# Altium schematic sheet HLK-7621-ALL-KIT-V1.0(020.2.25).SchDoc
size A1
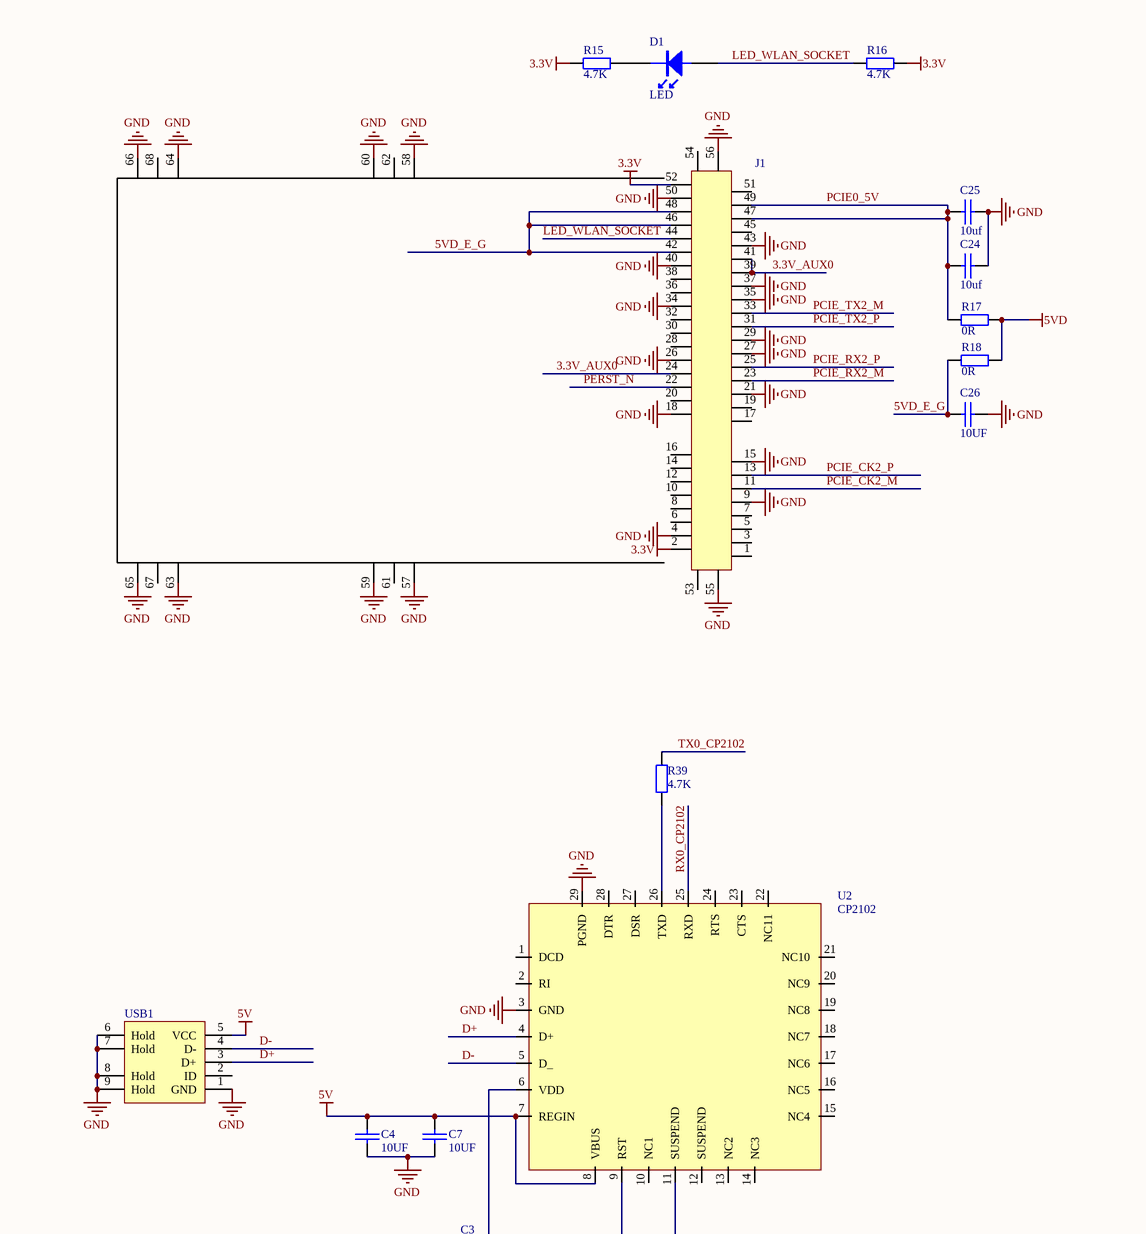
[diagram p0: HLK-7621-ALL-KIT-V1.0(020.2.25).SchDoc, top left]
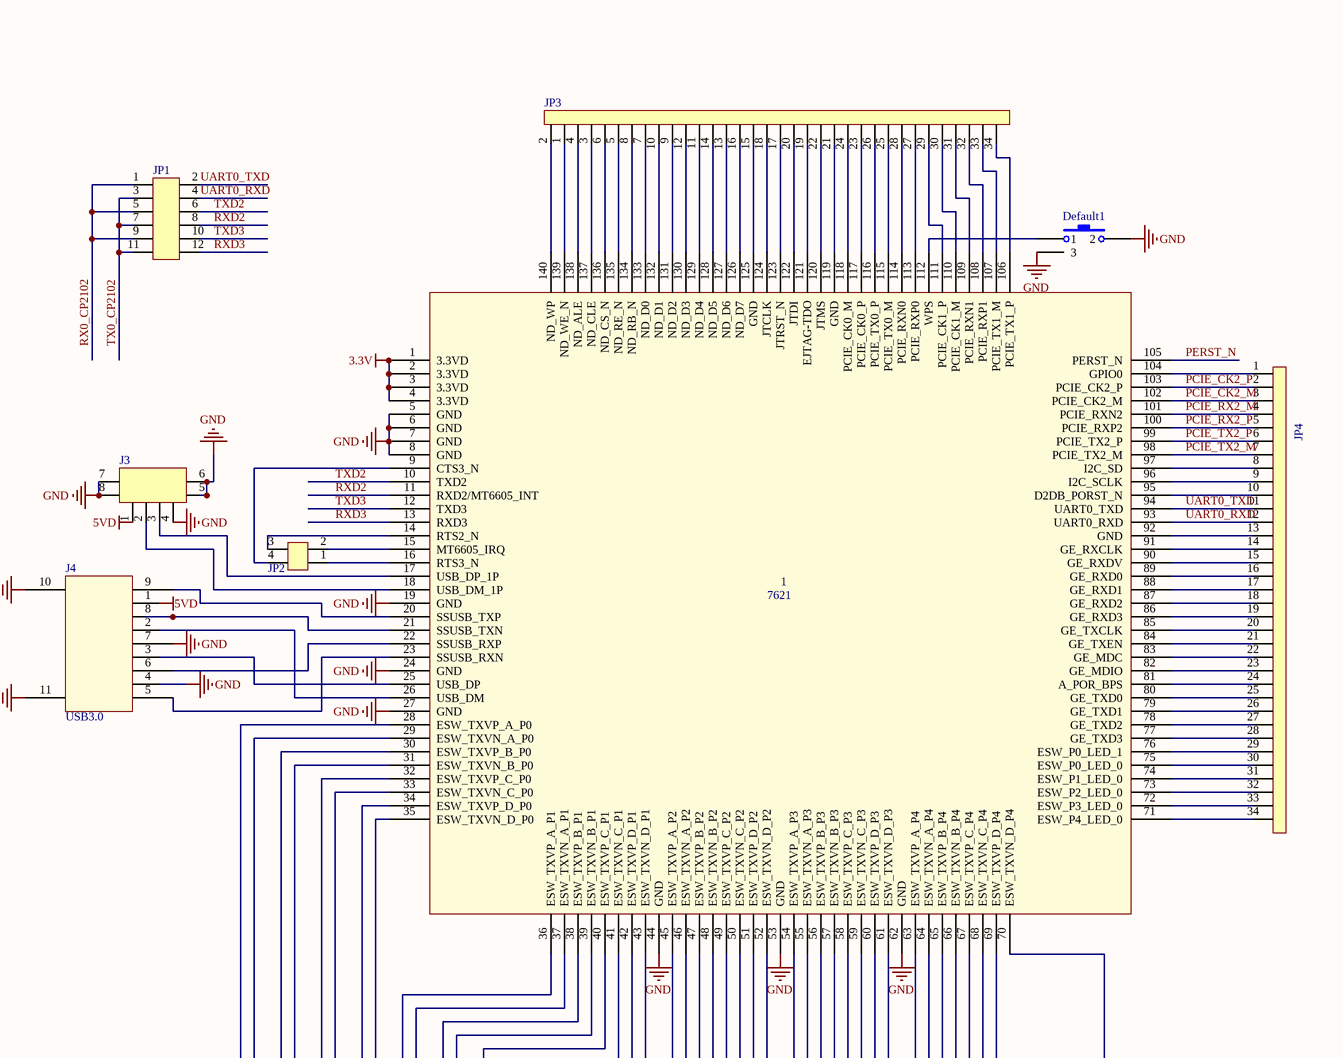
[diagram p1: HLK-7621-ALL-KIT-V1.0(020.2.25).SchDoc, top right]
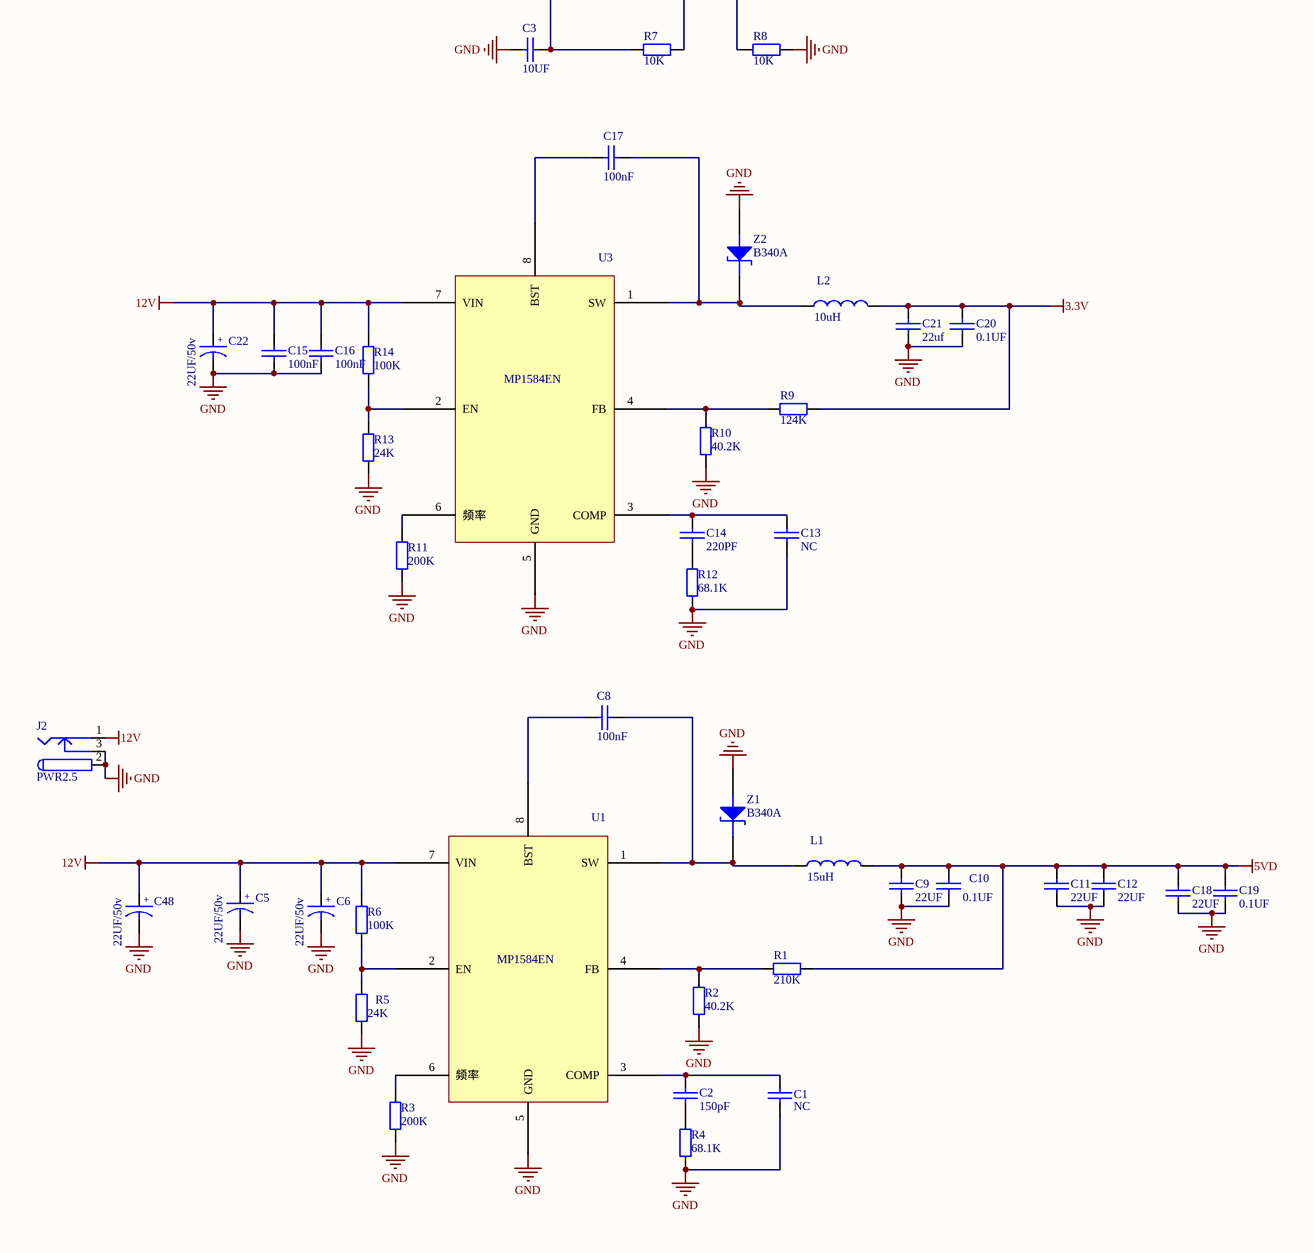
[diagram p2: HLK-7621-ALL-KIT-V1.0(020.2.25).SchDoc, bottom left]
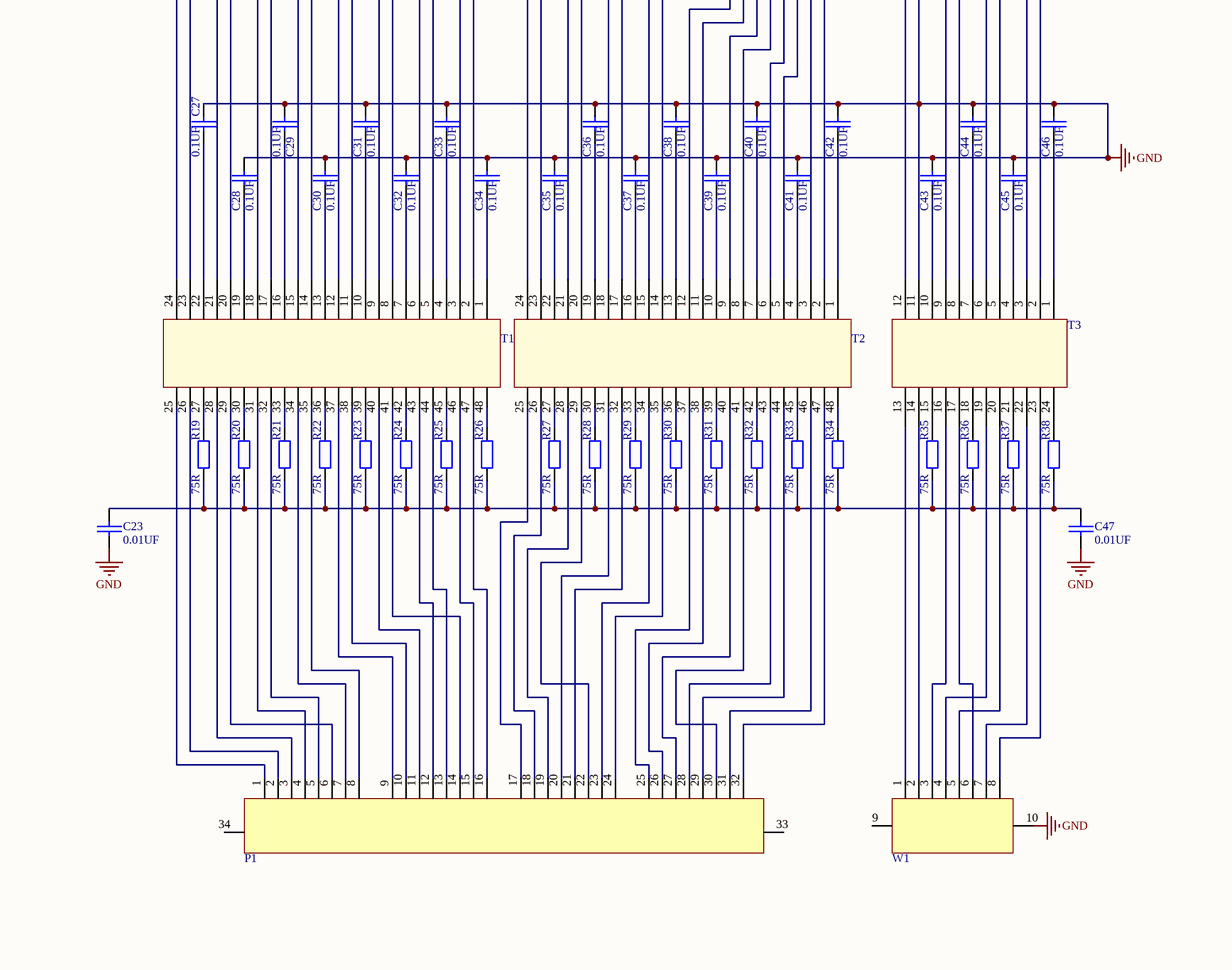
[diagram p3: HLK-7621-ALL-KIT-V1.0(020.2.25).SchDoc, bottom right]

## Parts
1  7621  [HLK-7621]
C1  NC  [0603]
C2  150pF  [0603]
C3  10UF  [0603L]
C4  10UF  [0603L]
C5  22UF/50v  [0603]
C6  22UF/50v  [0603]
C7  10UF  [0603L]
C8  100nF  [0603]
C9  22UF  [0603]
C10  0.1UF  [0603]
C11  22UF  [0603]
C12  22UF  [0603]
C13  NC  [0603]
C14  220PF  [0603]
C15  100nF  [0603]
C16  100nF  [0603]
C17  100nF  [0603]
C18  22UF  [0603]
C19  0.1UF  [0603]
C20  0.1UF  [0603]
C21  22uf  [0603]
C22  22UF/50v  [CAP_SMT_8*10.5]
C23  0.01UF  [C1206]
C24  10uf  [C1206]
C25  10uf  [C1206]
C26  10UF  [C1206]
C27  0.1UF  [C0402]
C28  0.1UF  [C0402]
C29  0.1UF  [C0402]
C30  0.1UF  [C0402]
C31  0.1UF  [C0402]
C32  0.1UF  [C0402]
C33  0.1UF  [C0402]
C34  0.1UF  [C0402]
C35  0.1UF  [C0402]
C36  0.1UF  [C0402]
C37  0.1UF  [C0402]
C38  0.1UF  [C0402]
C39  0.1UF  [C0402]
C40  0.1UF  [C0402]
C41  0.1UF  [C0402]
C42  0.1UF  [C0402]
C43  0.1UF  [C0402]
C44  0.1UF  [C0402]
C45  0.1UF  [C0402]
C46  0.1UF  [C0402]
C47  0.01UF  [C1206]
C48  22UF/50v  [CAP_SMT_8*10.5]
D1  LED  [C1206]
Default1  SW-PB  [K5]  (value not drawn)
J1  (no value)  [CONSG/54/MINICARD/AS0B22-S68-7F/HALF/FUL]
J2  PWR2.5
J3  (no value)
J4  USB3.0
JP1  (no value)  [HDR2X6]
JP2  (no value)  [HDR2X2]
JP3  (no value)  [HDR2X17]
JP4  2  [HDR2X17]  (value not drawn)
L1  15uH  [CD105]
L2  10uH  [CD105]
P1  Component_2  [PHJ8X4_N]  (value not drawn)
R1  210K  [0603]
R2  40.2K  [0603]
R3  200K  [0603]
R4  68.1K  [0603]
R5  24K  [0603]
R6  100K  [0603]
R7  10K  [0603L]
R8  10K  [0603L]
R9  124K  [0603]
R10  40.2K  [0603]
R11  200K  [0603]
R12  68.1K  [0603]
R13  24K  [0603]
R14  100K  [0603]
R15  4.7K  [0603]
R16  4.7K  [0603]
R17  0R  [L0805]
R18  0R  [R1206]
R19  75R  [R0402]
R20  75R  [R0402]
R21  75R  [R0402]
R22  75R  [R0402]
R23  75R  [R0402]
R24  75R  [R0402]
R25  75R  [R0402]
R26  75R  [R0402]
R27  75R  [R0402]
R28  75R  [R0402]
R29  75R  [R0402]
R30  75R  [R0402]
R31  75R  [R0402]
R32  75R  [R0402]
R33  75R  [R0402]
R34  75R  [R0402]
R35  75R  [R0402]
R36  75R  [R0402]
R37  75R  [R0402]
R38  75R  [R0402]
R39  4.7K  [0603]
T1  TRANSFORMER/24P/SMD/HN2429CG  [TRANSFORMER/48P/SMD/GS5014LF]  (value not drawn)
T2  TRANSFORMER/24P/SMD/HN2429CG  [TRANSFORMER/48P/SMD/GS5014LF]  (value not drawn)
T3  TRANSFORMER/24P/SMD/HN2429CG  [TRANSFORMER/24P/SMD/HN2429CG]  (value not drawn)
U1  MP1584EN  [SOP8_150]
U2  CP2102  [cp2102]
U3  MP1584EN  [SOP8_150]
USB1  USB1  [usb]  (value not drawn)
W1  Component_3  [PCBComponent_1]  (value not drawn)
Z1  B340A  [SMA]
Z2  B340A  [SMA]

## Nets
3.3V: 1.1(3.3VD) 1.2(3.3VD) 1.3(3.3VD) 1.4(3.3VD) C20.1 C21.1 J1.2 J1.52 L2.1 R9.1 R15.2 R16.1
5V: C4.2 C7.2 U2.7(REGIN) U2.8(VBUS) USB1.5(VCC)
5VD: C9.1 C10.1 C11.1 C12.1 C18.1 C19.1 J3.1 J4.1 L1.1 R1.1 R17.2 R18.1
12V: C5.1 C6.1 C15.1 C16.1 C22.1 C48.1 J2.1 R6.2 R14.2 U1.7(VIN) U3.7(VIN)
GND: 1.5(GND) 1.6(GND) 1.7(GND) 1.8(GND) 1.19(GND) 1.24(GND) 1.27(GND) 1.44(GND) 1.53(GND) 1.62(GND) 1.64(ESW_TXVN_A_P4) C1.2 C3.1 C4.1 C5.2 C6.2 C7.1 C9.2 C10.2 C11.2 C12.2 C13.2 C15.2 C16.2 C18.2 C19.2 C20.2 C21.2 C22.2 C23.2 C24.2 C25.2 C26.2 C27.1 C28.1 C29.1 C30.1 C31.1 C32.1 C33.1 C34.1 C35.1 C36.1 C37.1 C38.1 C39.1 C40.1 C41.1 C42.1 C43.1 C44.1 C45.1 C46.1 C47.2 C48.2 Default1.2 Default1.3 J1.4 J1.9 J1.15 J1.18 J1.21 J1.26 J1.27 J1.29 J1.34 J1.35 J1.37 J1.40 J1.43 J1.50 J1.55 J1.56 J1.57 J1.58 J1.59 J1.60 J1.63 J1.64 J1.65 J1.66 J2.2 J2.3 J3.4 J3.5 J3.6 J3.7 J3.8 J4.4 J4.7 J4.10 J4.11 R2.1 R3.1 R4.1 R5.1 R8.1 R10.1 R11.1 R12.1 R13.1 T3.11 U1.5(GND) U2.3(GND) U2.29(PGND) U3.5(GND) USB1.1(GND) USB1.6(Hold) USB1.7(Hold) USB1.8(Hold) USB1.9(Hold) W1.10 Z1.1(A) Z2.1(A)
3.3V_AUX0: J1.24 J1.39 J1.41
5VD_E_G: C26.1 J1.42 J1.46 J1.48 R18.2
D+: U2.4(D+) USB1.3(D+)
D-: U2.5(D_) USB1.4(D-)
LED_WLAN_SOCKET: D1.1 J1.44 R16.2
PCIE0_5V: C24.1 C25.1 J1.47 J1.49 R17.1
PCIE_CK2_M: 1.102(PCIE_CK2_M) J1.11 JP4.3
PCIE_CK2_P: 1.103(PCIE_CK2_P) J1.13 JP4.2
PCIE_RX2_M: 1.101(PCIE_RXN2) J1.23 JP4.4
PCIE_RX2_P: 1.100(PCIE_RXP2) J1.25 JP4.5
PCIE_TX2_M: 1.98(PCIE_TX2_M) J1.33 JP4.7
PCIE_TX2_P: 1.99(PCIE_TX2_P) J1.31 JP4.6
PERST_N: 1.105(PERST_N) J1.22
RX0_CP2102: JP1.1 JP1.5 JP1.9 U2.25(RXD)
RXD2: 1.11(RXD2/MT6605_INT) JP1.8
RXD3: 1.13(RXD3) JP1.12
TX0_CP2102: JP1.3 JP1.7 JP1.11 R39.1
TXD2: 1.10(TXD2) JP1.6
TXD3: 1.12(TXD3) JP1.10
UART0_RXD: 1.93(UART0_RXD) JP1.4 JP4.12
UART0_TXD: 1.94(UART0_TXD) JP1.2 JP4.11
Net1_9: 1.9(CTS3_N) JP2.4
Net1_14: 1.14(RTS2_N) JP2.3
Net1_15: 1.15(MT6605_IRQ) JP2.2
Net1_16: 1.16(RTS3_N) JP2.1
Net1_17: 1.17(USB_DP_1P) J3.3
Net1_18: 1.18(USB_DM_1P) J3.2
Net1_20: 1.20(SSUSB_TXP) J4.9
Net1_21: 1.21(SSUSB_TXN) J4.8
Net1_22: 1.22(SSUSB_RXP) J4.6
Net1_23: 1.23(SSUSB_RXN) J4.5
Net1_25: 1.25(USB_DP) J4.3
Net1_26: 1.26(USB_DM) J4.2
Net1_28: 1.28(ESW_TXVP_A_P0) T1.24
Net1_29: 1.29(ESW_TXVN_A_P0) T1.23
Net1_30: 1.30(ESW_TXVP_B_P0) T1.21
Net1_31: 1.31(ESW_TXVN_B_P0) T1.20
Net1_32: 1.32(ESW_TXVP_C_P0) T1.18
Net1_33: 1.33(ESW_TXVN_C_P0) T1.17
Net1_34: 1.34(ESW_TXVP_D_P0) T1.15
Net1_35: 1.35(ESW_TXVN_D_P0) T1.14
Net1_36: 1.36(ESW_TXVP_A_P1) T1.12
Net1_37: 1.37(ESW_TXVN_A_P1) T1.11
Net1_38: 1.38(ESW_TXVP_B_P1) T1.9
Net1_39: 1.39(ESW_TXVN_B_P1) T1.8
Net1_40: 1.40(ESW_TXVP_C_P1) T1.6
Net1_41: 1.41(ESW_TXVN_C_P1) T1.5
Net1_42: 1.42(ESW_TXVP_D_P1) T1.3
Net1_43: 1.43(ESW_TXVN_D_P1) T1.2
Net1_45: 1.45(ESW_TXVP_A_P2) T2.24
Net1_46: 1.46(ESW_TXVN_A_P2) T2.23
Net1_47: 1.47(ESW_TXVP_B_P2) T2.21
Net1_48: 1.48(ESW_TXVN_B_P2) T2.20
Net1_49: 1.49(ESW_TXVP_C_P2) T2.18
Net1_50: 1.50(ESW_TXVN_C_P2) T2.17
Net1_51: 1.51(ESW_TXVP_D_P2) T2.15
Net1_52: 1.52(ESW_TXVN_D_P2) T2.14
Net1_54: 1.54(ESW_TXVP_A_P3) T2.12
Net1_55: 1.55(ESW_TXVN_A_P3) T2.11
Net1_56: 1.56(ESW_TXVP_B_P3) T2.9
Net1_57: 1.57(ESW_TXVN_B_P3) T2.8
Net1_58: 1.58(ESW_TXVP_C_P3) T2.6
Net1_59: 1.59(ESW_TXVN_C_P3) T2.5
Net1_60: 1.60(ESW_TXVP_D_P3) T2.3
Net1_61: 1.61(ESW_TXVN_D_P3) T2.2
Net1_63: 1.63(ESW_TXVP_A_P4) T3.12
Net1_65: 1.65(ESW_TXVP_B_P4) T3.9
Net1_66: 1.66(ESW_TXVN_B_P4) T3.8
Net1_67: 1.67(ESW_TXVP_C_P4) T3.6
Net1_68: 1.68(ESW_TXVN_C_P4) T3.5
Net1_69: 1.69(ESW_TXVP_D_P4) T3.3
Net1_70: 1.70(ESW_TXVN_D_P4) T3.2
Net1_71: 1.71(ESW_P4_LED_0) JP4.34
Net1_72: 1.72(ESW_P3_LED_0) JP4.33
Net1_73: 1.73(ESW_P2_LED_0) JP4.32
Net1_74: 1.74(ESW_P1_LED_0) JP4.31
Net1_75: 1.75(ESW_P0_LED_0) JP4.30
Net1_76: 1.76(ESW_P0_LED_1) JP4.29
Net1_77: 1.77(GE_TXD3) JP4.28
Net1_78: 1.78(GE_TXD2) JP4.27
Net1_79: 1.79(GE_TXD1) JP4.26
Net1_80: 1.80(GE_TXD0) JP4.25
Net1_81: 1.81(A_POR_BPS) JP4.24
Net1_82: 1.82(GE_MDIO) JP4.23
Net1_83: 1.83(GE_MDC) JP4.22
Net1_84: 1.84(GE_TXEN) JP4.21
Net1_85: 1.85(GE_TXCLK) JP4.20
Net1_86: 1.86(GE_RXD3) JP4.19
Net1_87: 1.87(GE_RXD2) JP4.18
Net1_88: 1.88(GE_RXD1) JP4.17
Net1_89: 1.89(GE_RXD0) JP4.16
Net1_90: 1.90(GE_RXDV) JP4.15
Net1_91: 1.91(GE_RXCLK) JP4.14
Net1_92: 1.92(GND) JP4.13
Net1_95: 1.95(D2DB_PORST_N) JP4.10
Net1_96: 1.96(I2C_SCLK) JP4.9
Net1_97: 1.97(I2C_SD) JP4.8
Net1_104: 1.104(GPIO0) JP4.1
Net1_106: 1.106(PCIE_TX1_P) JP3.34
Net1_107: 1.107(PCIE_TX1_M) JP3.33
Net1_108: 1.108(PCIE_RXP1) JP3.32
Net1_109: 1.109(PCIE_RXN1) JP3.31
Net1_110: 1.110(PCIE_CK1_M) JP3.30
Net1_111: 1.111(PCIE_CK1_P) JP3.29
Net1_112: 1.112(WPS) Default1.1
Net1_113: 1.113(PCIE_RXP0) JP3.27
Net1_114: 1.114(PCIE_RXN0) JP3.28
Net1_115: 1.115(PCIE_TX0_M) JP3.25
Net1_116: 1.116(PCIE_TX0_P) JP3.26
Net1_117: 1.117(PCIE_CK0_P) JP3.23
Net1_118: 1.118(PCIE_CK0_M) JP3.24
Net1_119: 1.119(GND) JP3.21
Net1_120: 1.120(JTMS) JP3.22
Net1_121: 1.121(EJTAG-TDO) JP3.19
Net1_122: 1.122(JTDI) JP3.20
Net1_123: 1.123(JTRST_N) JP3.17
Net1_124: 1.124(JTCLK) JP3.18
Net1_125: 1.125(GND) JP3.15
Net1_126: 1.126(ND_D7) JP3.16
Net1_127: 1.127(ND_D6) JP3.13
Net1_128: 1.128(ND_D5) JP3.14
Net1_129: 1.129(ND_D4) JP3.11
Net1_130: 1.130(ND_D3) JP3.12
Net1_131: 1.131(ND_D2) JP3.9
Net1_132: 1.132(ND_D1) JP3.10
Net1_133: 1.133(ND_D0) JP3.7
Net1_134: 1.134(ND_RB_N) JP3.8
Net1_135: 1.135(ND_RE_N) JP3.5
Net1_136: 1.136(ND_CS_N) JP3.6
Net1_137: 1.137(ND_CLE) JP3.3
Net1_138: 1.138(ND_ALE) JP3.4
Net1_139: 1.139(ND_WE_N) JP3.1
Net1_140: 1.140(ND_WP) JP3.2
NetC1_1: C1.1 C2.1 U1.3(COMP)
NetC2_2: C2.2 R4.2
NetC3_2: C3.2 R7.1 U2.6(VDD)
NetC8_1: C8.1 U1.8(BST)
NetC8_2: C8.2 L1.2 U1.1(SW) Z1.2(K)
NetC13_1: C13.1 C14.1 U3.3(COMP)
NetC14_2: C14.2 R12.2
NetC17_1: C17.1 U3.8(BST)
NetC17_2: C17.2 L2.2 U3.1(SW) Z2.2(K)
NetC23_1: C23.1 C47.1 R19.1 R20.1 R21.1 R22.1 R23.1 R24.1 R25.1 R26.1 R27.1 R28.1 R29.1 R30.1 R31.1 R32.1 R33.1 R34.1 R35.1 R36.1 R37.1 R38.1
NetC27_2: C27.2 T1.22
NetC28_2: C28.2 T1.19
NetC29_2: C29.2 T1.16
NetC30_2: C30.2 T1.13
NetC31_2: C31.2 T1.10
NetC32_2: C32.2 T1.7
NetC33_2: C33.2 T1.4
NetC34_2: C34.2 T1.1
NetC35_2: C35.2 T2.22
NetC36_2: C36.2 T2.19
NetC37_2: C37.2 T2.16
NetC38_2: C38.2 T2.13
NetC39_2: C39.2 T2.10
NetC40_2: C40.2 T2.7
NetC41_2: C41.2 T2.4
NetC42_2: C42.2 T2.1
NetC43_2: C43.2 T3.10
NetC44_2: C44.2 T3.7
NetC45_2: C45.2 T3.4
NetC46_2: C46.2 T3.1
NetD1_2: D1.2 R15.1
NetP1_1: P1.1 T1.25
NetP1_2: P1.2 T1.26
NetP1_3: P1.3 T1.28
NetP1_4: P1.4 T1.31
NetP1_5: P1.5 T1.32
NetP1_6: P1.6 T1.29
NetP1_7: P1.7 T1.34
NetP1_8: P1.8 T1.35
NetP1_9: P1.9 T1.37
NetP1_10: P1.10 T1.38
NetP1_11: P1.11 T1.40
NetP1_12: P1.12 T1.43
NetP1_13: P1.13 T1.44
NetP1_14: P1.14 T1.41
NetP1_15: P1.15 T1.46
NetP1_16: P1.16 T1.47
NetP1_17: P1.17 T2.25
NetP1_18: P1.18 T2.26
NetP1_19: P1.19 T2.28
NetP1_20: P1.20 T2.31
NetP1_21: P1.21 T2.32
NetP1_22: P1.22 T2.29
NetP1_23: P1.23 T2.34
NetP1_24: P1.24 T2.35
NetP1_25: P1.25 T2.37
NetP1_26: P1.26 T2.38
NetP1_27: P1.27 T2.40
NetP1_28: P1.28 T2.43
NetP1_29: P1.29 T2.44
NetP1_30: P1.30 T2.41
NetP1_31: P1.31 T2.46
NetP1_32: P1.32 T2.47
NetR1_2: R1.2 R2.2 U1.4(FB)
NetR3_2: R3.2 U1.6(频率)
NetR5_2: R5.2 R6.1 U1.2(EN)
NetR7_2: R7.2 U2.9(RST)
NetR8_2: R8.2 U2.11(SUSPEND)
NetR9_2: R9.2 R10.2 U3.4(FB)
NetR11_2: R11.2 U3.6(频率)
NetR13_2: R13.2 R14.1 U3.2(EN)
NetR19_2: R19.2 T1.27
NetR20_2: R20.2 T1.30
NetR21_2: R21.2 T1.33
NetR22_2: R22.2 T1.36
NetR23_2: R23.2 T1.39
NetR24_2: R24.2 T1.42
NetR25_2: R25.2 T1.45
NetR26_2: R26.2 T1.48
NetR27_2: R27.2 T2.27
NetR28_2: R28.2 T2.30
NetR29_2: R29.2 T2.33
NetR30_2: R30.2 T2.36
NetR31_2: R31.2 T2.39
NetR32_2: R32.2 T2.42
NetR33_2: R33.2 T2.45
NetR34_2: R34.2 T2.48
NetR35_2: R35.2 T3.15
NetR36_2: R36.2 T3.18
NetR37_2: R37.2 T3.21
NetR38_2: R38.2 T3.24
NetR39_2: R39.2 U2.26(TXD)
NetT3_13: T3.13 W1.1
NetT3_14: T3.14 W1.2
NetT3_16: T3.16 W1.3
NetT3_17: T3.17 W1.6
NetT3_19: T3.19 W1.4
NetT3_20: T3.20 W1.5
NetT3_22: T3.22 W1.7
NetT3_23: T3.23 W1.8

Not connected (* = marked no-connect by the designer): J1 1(0) 3 5 6 7 8 10 12 14 16 17 19 20 28 30 32 36 38 45 51 53 54 61 62 67 68; P1 33 34; U2 1(DCD) 2(RI) 10(NC1) 12(SUSPEND) 13(NC2) 14(NC3) 15(NC4) 16(NC5) 17(NC6) 18(NC7) 19(NC8) 20(NC9) 21(NC10) 22(NC11) 23(CTS) 24(RTS) 27(DSR) 28(DTR); USB1 2(ID); W1 9

## Notes on the sheet
- (in symbol CAPACITOR POL) +

## Library data of the parts
C1-C4 C7-C21 C23-C47 = CAP: Capacitor
C5 C6 C22 C48 = CAPACITOR POL: Capacitor
Default1 = SW-PB: Switch; Published: 24-Mar-1999; LatestRevisionDate: 17-Jul-2002; LatestRevisionNote: Re-released for DXP Platform.; PackageReference: SPST-2; Publisher: Altium Limited
J1 JP1 U1-U3 = Component_1
J2 = PWR2.5: Low Voltage Power Supply Connector; Published: 17-Dec-2003; DatasheetDocument: 09-May-2002; Publisher: Altium Limited; ComponentLink1Description: Manufacturer Link; ComponentLink1URL: http://domino.kycon.com/internet/Products.html
J3 JP2 JP3 = 2
J4 = USB3.0/9P/DIP/MAINSUPER
L1 L2 = INDUCTOR1
R1-R39 = Res2: Resistor; Published: 8-Jun-2000; LatestRevisionDate: 17-Jul-2002; LatestRevisionNote: Re-released for DXP Platform.; PackageReference: AXIAL-0.4; Publisher: Altium Limited
  R1: Value: 210K
  R2 R10: Value: 40.2K
  R3 R11: Value: 200K
  R4 R12: Value: 68.1K
  R5 R13: Value: 24K
  R6 R14: Value: 100K
  R7 R8: Value: 10K
  R9: Value: 124K
  R15 R16 R39: Value: 4.7K
  R17 R18: Value: 0R
USB1 = USB-B
Z1 Z2 = ZENER2: Zener Diode